# Altium schematic sheet PLC1_3.SchDoc
size 420 x 297 mm; SheetNumber: 3; Scale: {Масш.}; Title1str: {Наименование}; PageSetup: Record=PageOptions|CenterHorizontal=False|CenterVertical=False|PrintScale=0.67|XCorrection=0.00|YCorrection=0.00|PrintKind=1|BorderSize=5000000|LeftOffset=0|BottomOffset=0|Orientation=2|PaperLength=1000|PaperWidth=1000|Scale=100|PaperSource=7|PrintQuality=600|MediaType=1|DitherType=10|PaperKind=A4|PrintScaleMode=1; Title2str: {Наименование}; ProcessInspection: {Т.контр.}; Mass: {Масса}; NormInspection: {Н.контр.}; EngineerName: {Инженер}; Letter1Column: {}; Letter2Column: {}; Letter3Column: {}; DocumentType: ?????????????? ?????; DocumentType1str: {Документ}; DocumentType2str: {Документ}
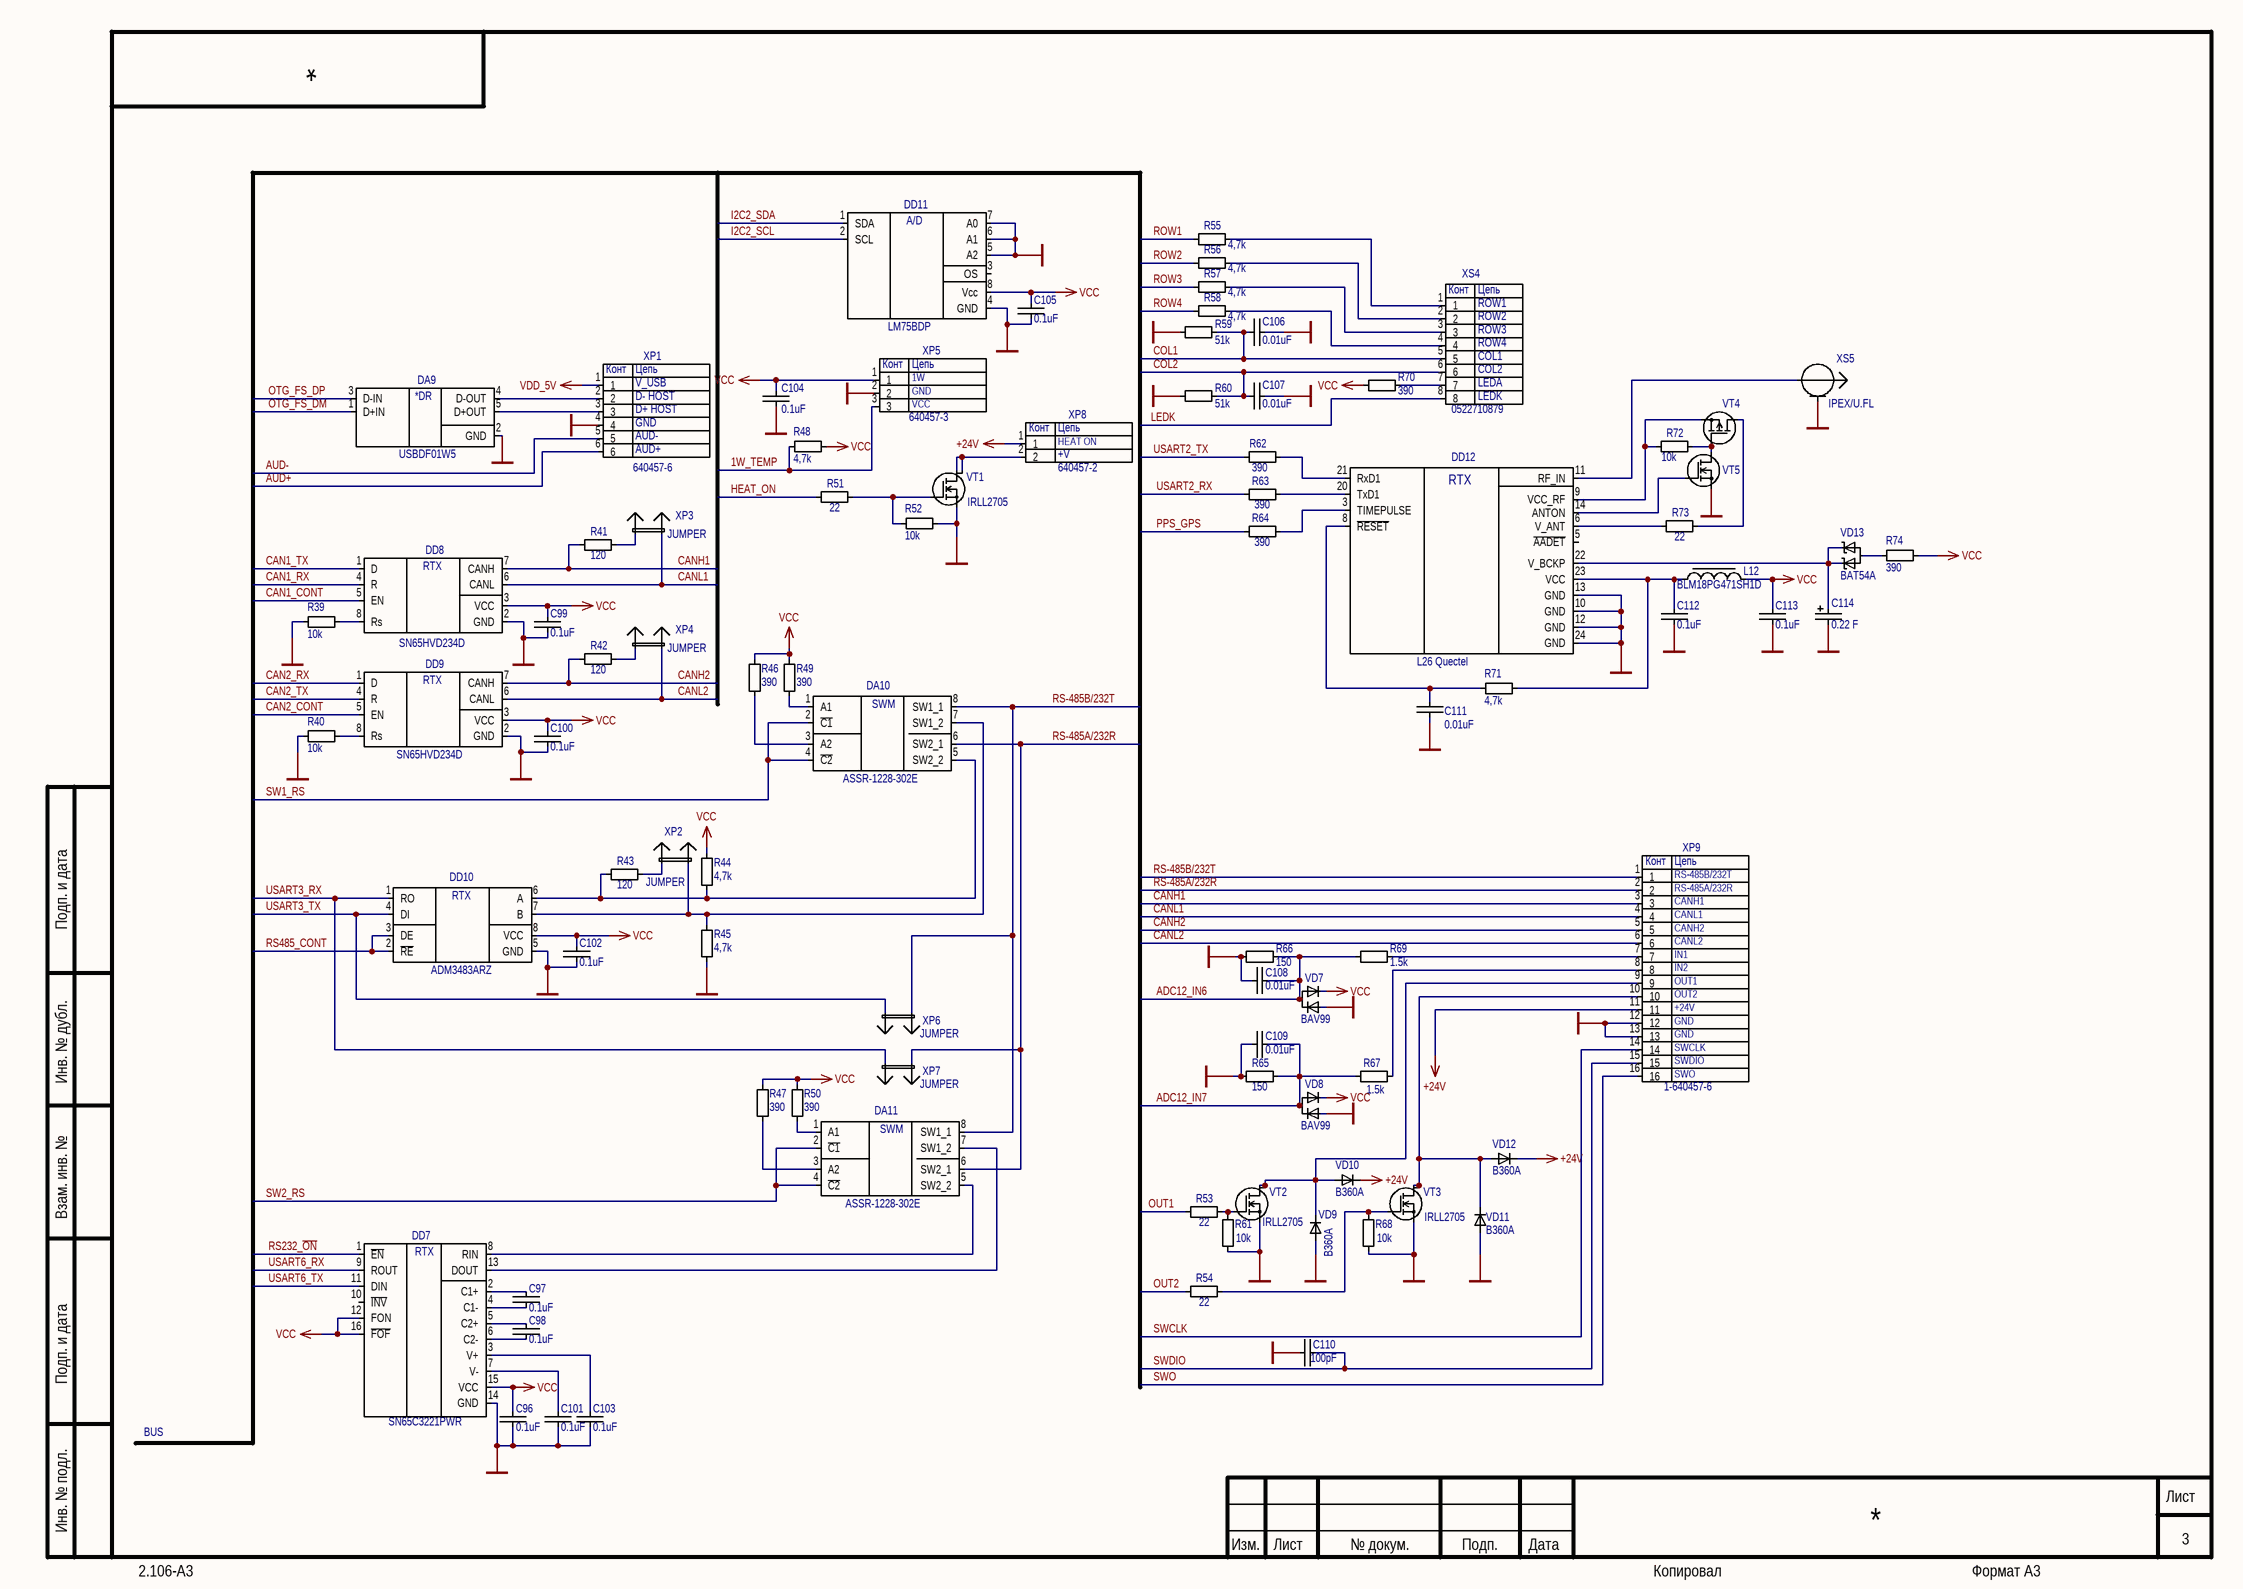
[diagram p0: PLC1_3.SchDoc]

## Parts
C96  0.1uF  [CAP_0603]
C97  0.1uF  [CAP_0603]
C98  0.1uF  [CAP_0603]
C99  0.1uF  [CAP_0603]
C100  0.1uF  [CAP_0603]
C101  0.1uF  [CAP_0603]
C102  0.1uF  [CAP_0603]
C103  0.1uF  [CAP_0603]
C104  0.1uF  [CAP_0603]
C105  0.1uF  [CAP_0603]
C106  0.01uF  [CAP_0603]
C107  0.01uF  [CAP_0603]
C108  0.01uF  [CAP_0603]
C109  0.01uF  [CAP_0603]
C110  value 100pF  [CAP_0603]  (hidden comment: 100p)
C111  0.01uF  [CAP_0603]
C112  0.1uF  [CAP_0603]
C113  0.1uF  [CAP_0603]
C114  0.22 F  [KR-5R5C104-R]
DA9  USBDF01W5  [SOT323-5L]
DA10  ASSR-1228-302E  [DIP8_GULL]
DA11  ASSR-1228-302E  [DIP8_GULL]
DD7  SN65C3221PWR  [TSSO5x6-G16]
DD8  SN65HVD234D  [SOIC8]
DD9  SN65HVD234D  [SOIC8]
DD10  Part Number: ADM3483ARZ  [SOIC8]  (hidden comment: ADM3483)
DD11  LM75BDP  [TSSO3x5-G8/X.4]
DD12  L26 Quectel  [VK1612U]
L12  BLM18PG471SH1D  [R_IND_0603]
R39  10k  [RES_0603]
R40  10k  [RES_0603]
R41  120  [Res_2010]
R42  120  [Res_2010]
R43  120  [Res_2010]
R44  4,7k  [RES_0603]
R45  4,7k  [RES_0603]
R46  390  [RES_0603]
R47  390  [RES_0603]
R48  4,7k  [Res_0603]
R49  390  [RES_0603]
R50  390  [RES_0603]
R51  22  [RES_0603]
R52  10k  [RES_0603]
R53  22  [RES_0603]
R54  22  [RES_0603]
R55  4,7k  [Res_0603]
R56  4,7k  [Res_0603]
R57  4,7k  [Res_0603]
R58  4,7k  [Res_0603]
R59  51k  [RES_0603]
R60  51k  [RES_0603]
R61  10k  [RES_0603]
R62  390  [RES_0603]
R63  390  [RES_0603]
R64  390  [RES_0603]
R65  value 150  [Res_1206]  (hidden comment: Res_1206)
R66  value 150  [Res_1206]  (hidden comment: Res_1206)
R67  value 1.5k  [Res_1206]  (hidden comment: Res_1206)
R68  10k  [RES_0603]
R69  value 1.5k  [Res_1206]  (hidden comment: Res_1206)
R70  390  [RES_0603]
R71  4,7k  [Res_0603]
R72  10k  [RES_0603]
R73  22  [RES_0603]
R74  390  [RES_0603]
VD7  BAV99  [SOT-23]
VD8  BAV99  [SOT-23]
VD9  B360A  [DO-214AC]
VD10  B360A  [DO-214AC]
VD11  B360A  [DO-214AC]
VD12  B360A  [DO-214AC]
VD13  BAT54A  [SOT-23]
VT1  Part Number: IRLL2705  [SOT-223]  (hidden comment: N-CHAN_SOT-223)
VT2  Part Number: IRLL2705  [SOT-223]  (hidden comment: N-CHAN_SOT-223)
VT3  Part Number: IRLL2705  [SOT-223]  (hidden comment: N-CHAN_SOT-223)
VT4  IRLML6402  [SOT-23]  (value not drawn)
VT5  N-CHAN_SOT-23  [SOT-23]  (value not drawn)
XP1  640457-6  [640457-6]
XP2  JUMPER  [PLS2-R]
XP3  JUMPER  [PLS2-R]
XP4  JUMPER  [PLS2-R]
XP5  640457-3  [640457-3]
XP6  JUMPER  [JMPTOPOLOGY]
XP7  JUMPER  [JMPTOPOLOGY]
XP8  640457-2  [640457-2]
XP9  1-640457-6  [1-640457-6]
XS4  0522710879  [0522710879]
XS5  IPEX/U.FL  [IPEX MHFI]

## Nets
+24V: VD10.2 VD12.2 XP8.1 XP9.11
GND: C96.2 C99.2 C100.2 C101.2 C102.2 C103.2 C104.2 C105.2 C106.1 C107.1 C108.1 C109.1 C110.2 C111.2 C112.2 C113.2 C114.2 DA9.2(GND) DD7.14(GND) DD8.2(GND) DD9.2(GND) DD10.5(GND) DD11.4(GND) DD11.5(A2) DD11.6(A1) DD11.7(A0) DD12.10(GND) DD12.12(GND) DD12.13(GND) DD12.24(GND) R39.2 R40.2 R45.2 R52.1 R59.2 R60.2 R61.1 R65.2 R66.2 R68.1 VD7.1 VD8.1 VD9.1 VD11.1 VT1.3 VT2.3 VT3.3 VT5.2 XP1.4 XP5.2 XP9.12 XP9.13 XS5.2
VCC: C96.1 C99.1 C100.1 C102.1 C104.1 C105.1 C113.1 DD7.12(FON) DD7.15(VCC) DD7.16(~{FOF}) DD8.3(VCC) DD9.3(VCC) DD10.8(VCC) DD11.8(Vcc) L12.1 R44.1 R46.1 R47.1 R48.1 R49.1 R50.1 R70.1 R74.2 VD7.2 VD8.2 XP5.1
VDD_5V: XP1.1
1W_TEMP: R48.2 XP5.3
ADC12_IN6: C108.2 R66.1 R69.2 VD7.3
ADC12_IN7: C109.2 R65.1 R67.2 VD8.3
AUD+: XP1.6
AUD-: XP1.5
CAN1_CONT: DD8.5(EN)
CAN1_RX: DD8.4(R)
CAN1_TX: DD8.1(D)
CAN2_CONT: DD9.5(EN)
CAN2_RX: DD9.1(D)
CAN2_TX: DD9.4(R)
CANH1: DD8.7(CANH) R41.1 XP9.3
CANH2: DD9.7(CANH) R42.1 XP9.5
CANL1: DD8.6(CANL) XP3.2 XP9.4
CANL2: DD9.6(CANL) XP4.2 XP9.6
COL1: C106.2 R59.1 XS4.5
COL2: C107.2 R60.1 XS4.6
HEAT_ON: R51.1
I2C2_SCL: DD11.2(SCL)
I2C2_SDA: DD11.1(SDA)
LEDK: XS4.8
OTG_FS_DM: DA9.1(D+IN)
OTG_FS_DP: DA9.3(D-IN)
OUT1: R53.1
OUT2: R54.1
PPS_GPS: R64.1
ROW1: R55.2
ROW2: R56.2
ROW3: R57.2
ROW4: R58.2
RS232_~{ON}: DD7.1(~{EN})
RS485_CONT: DD10.2(~{RE}) DD10.3(DE)
RS-485A/232R: DA10.6(SW2_1) DA11.6(SW2_1) XP7.1 XP9.2
RS-485B/232T: DA10.8(SW1_1) DA11.8(SW1_1) XP6.1 XP9.1
SW1_RS: DA10.2(~{C1}) DA10.4(~{C2})
SW2_RS: DA11.2(~{C1}) DA11.4(~{C2})
SWCLK: XP9.14
SWDIO: C110.1 XP9.15
SWO: XP9.16
USART2_RX: R63.1
USART2_TX: R62.1
USART3_RX: DD10.1(RO) XP7.2
USART3_TX: DD10.4(DI) XP6.2
USART6_RX: DD7.9(ROUT)
USART6_TX: DD7.11(DIN)
NetC97_1: C97.1 DD7.2(C1+)
NetC97_2: C97.2 DD7.4(C1-)
NetC98_1: C98.1 DD7.5(C2+)
NetC98_2: C98.2 DD7.6(C2-)
NetC101_1: C101.1 DD7.7(V-)
NetC103_1: C103.1 DD7.3(V+)
NetC111_1: C111.1 DD12.8(~{RESET}) R71.2
NetC112_1: C112.1 DD12.23(VCC) L12.2 R71.1
NetC114_1: C114.1 DD12.22(V_BCKP) VD13.1 VD13.2
NetDA9_4: DA9.4(D-OUT) XP1.2
NetDA9_5: DA9.5(D+OUT) XP1.3
NetDA10_1: DA10.1(A1) R49.2
NetDA10_3: DA10.3(A2) R46.2
NetDA10_5: DA10.5(SW2_2) DD10.6(A) R43.1 R44.2
NetDA10_7: DA10.7(SW1_2) DD10.7(B) R45.1 XP2.2
NetDA11_1: DA11.1(A1) R50.2
NetDA11_3: DA11.3(A2) R47.2
NetDA11_5: DA11.5(SW2_2) DD7.8(RIN)
NetDA11_7: DA11.7(SW1_2) DD7.13(DOUT)
NetDD8_8: DD8.8(Rs) R39.1
NetDD9_8: DD9.8(Rs) R40.1
NetDD12_3: DD12.3(TIMEPULSE) R64.2
NetDD12_6: DD12.6(V_ANT) R73.1
NetDD12_9: DD12.9(VCC_RF) R72.2 VT4.2
NetDD12_11: DD12.11(RF_IN) XS5.1
NetDD12_14: DD12.14(ANTON) VT5.1
NetDD12_20: DD12.20(TxD1) R63.2
NetDD12_21: DD12.21(RxD1) R62.2
NetR41_2: R41.2 XP3.1
NetR42_2: R42.2 XP4.1
NetR43_2: R43.2 XP2.1
NetR51_2: R51.2 R52.2 VT1.1
NetR53_2: R53.2 R61.2 VT2.1
NetR54_2: R54.2 R68.2 VT3.1
NetR55_1: R55.1 XS4.1
NetR56_1: R56.1 XS4.2
NetR57_1: R57.1 XS4.3
NetR58_1: R58.1 XS4.4
NetR67_1: R67.1 XP9.8
NetR69_1: R69.1 XP9.7
NetR70_2: R70.2 XS4.7
NetR72_1: R72.1 VT4.1 VT5.3
NetR73_2: R73.2 VT4.3
NetR74_1: R74.1 VD13.3
NetVD9_2: VD9.2 VD10.1 VT2.2 VT2.4 XP9.9
NetVD11_2: VD11.2 VD12.1 VT3.2 VT3.4 XP9.10
NetVT1_2: VT1.2 VT1.4 XP8.2

Not connected (* = marked no-connect by the designer): DD7 10(~{INV}); DD11 3(OS); DD12 5(~{AADET})

## Notes on the sheet
- (near XS4) ROW1
- (near XS4) ROW2
- (near XP1) Конт
- (near XP1) V_USB
- (near XP1) Цепь
- (near XP5) Конт
- Цепь
- (near XP5) 1W
- (near XP5) GND
- (near XS4) ROW3
- (near XS4) ROW4
- (near XS4) COL1
- (near XS4) COL2
- (near XS4) LEDA
- (near XP1) D+ HOST
- (near XP1) D- HOST
- (near XP1) GND
- (near XP1) AUD-
- (near XP1) AUD+
- (near XP5) VCC
- (near XP8) Конт
- (near XP8) Цепь
- (near XP8) HEAT ON
- (near XP8) +V
- (near XS4) LEDK
- (near XP9) Конт
- (near XP9) Цепь
- (near XP9) RS-485B/232T
- (near XP9) RS-485A/232R
- (near XP9) CANH1
- (near XP9) CANL1
- (near XP9) CANH2
- (near XP9) CANL2
- (near XP9) IN1
- (near XP9) IN2
- (near XP9) OUT1
- (near XP9) OUT2
- (near XP9) +24V
- (near XP9) GND
- (near XP9) SWCLK
- (near XP9) SWDIO
- (near XP9) SWO
- BUS
- Подп. и дата
- Инв. № дубл.
- Взам. инв. №
- Инв. № подл.
- Изм.
- Лист
- № докум.
- Подп.
- Дата
- 2.106-A3
- Копировал
- Формат А3
- (in symbol 0522710879) Конт; Цепь
- (in symbol ADM3483) RTX
- (in symbol ASSR-1228-302E) SWM
- (in symbol L26 Quectel) RTX
- (in symbol LM75BDP) A/D
- (in symbol SN65C3221PWR) RTX
- (in symbol SN65HVD234D) RTX
- (in symbol USBDF01W6) *DR

## Library data of the parts
C96-C105 C112 C113 = Cap_0603: Manufacturer: AVX; Part Number: 0603YC104KAT2A; Replacement: GRM188R71E104KA12D; PackageReference: 0603; Value: 0.1uF; Distributor: http://www.rospek.ru; Price: 0.001$
C106-C109 C111 = Cap_0603: Manufacturer: AVX; Part Number: 0603YC103KAT2A; Replacement: GRM188R71E103KA12D; PackageReference: 0603; Value: 0.01uF; Distributor: http://www.rospek.ru; Price: 0.001$
C110 = Cap_0603: Manufacturer: Yageo; Part Number: CC0603JRNPO9BN101; Replacement: 100pF 0603 NP0; PackageReference: 0603; Distributor: http://www.platan.ru/; Price: 0.02$
C114 = KR-5R5C104-R: supercapacitor 0.22 uF; Manufacturer: Panasonic; Replacement: KR-5R5C224-R; Value: 0.1F; PackageReference: AXIAL 10; Part Number: KR-5R5C224-R; Distributor: panasonic.com; Price: 0.6$
DA9 = USBDF01W6: Unidirectional 2 lines Filter + ESD; Manufacturer: ST; Replacement: USBDF02W5; Price: 0.5$; Distributor: http://st.com; PackageReference: SOT-323-5; Part Number: USBDF01W5
DA10 DA11 = ASSR-1228-302E: RS-485 PHY; Manufacturer: AVAGO; Price: 2.1$; Distributor: http://www.avagotech.com; Value: ASSR-1228-302E; Replacement: ASSR-1228-302E; PackageReference: PDIP-8 GULL; Part Number: ASSR-1228-302E
DD7 = SN65C3221PWR: RS-232 PHY CAN PHY; Manufacturer: TI; Replacement: SP3221E EXAR; Price: 1.05$; Distributor: http://ti.com; PackageReference: TSSOP-16; Part Number: SN65C3221PWR
DD8 DD9 = SN65HVD234D: SN65HVD234D CAN PHY; Manufacturer: TI; Price: 1.5$; Distributor: http://ti.com; Replacement: SN65HVD234D; PackageReference: SO-8; Part Number: SN65HVD234D
DD10 = ADM3483: RS-485 PHY; Manufacturer: Analog Devices; Price: 1.1$; Distributor: http://analog.com; Replacement: ADM3483ARZ; PackageReference: SO-8 narrow
DD11 = LM75BDP: LM75BDP TEMPERATURE SENSOR; Manufacturer: NXP; Price: 0.4$; Distributor: http://nxp.com; Replacement: LM75BDP; PackageReference: TSSOP; Part Number: LM75BDP
DD12 = L26 Quectel: GPS receiver; Price: 8$; Replacement: L26 Quectel; PackageReference: LLC 24; Manufacturer: Quectel; Part Number: L26 Quectel
L12 = FCM1608KF-601T03: Manufacturer: Murata; Replacement: 600 ohm @100 MHz; PackageReference: 0603; Part Number: BLM18PG471SH1D; Distributor: http://www.chipdip.ru; Price: 0.1$; Value: BLM18PG471SH1D
R39 R40 R52 R61 R68 R72 = Res_0603: 0603, 10k; Manufacturer: Vishay; Part Number: CRCW060310K0JNE; Replacement: 0603 10 kOhm 5%; PackageReference: 0603; Distributor: http://www.kontest.ru; Price: 0.01$; Value: 10k
R41-R43 = Res_2010: 2010; Manufacturer: NIC Components Corp.; Part Number: NRC50J121TRF; PackageReference: 2010; Value: 120; Price: 0.1$
R44 R45 R48 R55-R58 R71 = Res_0603: 0603, 100; Manufacturer: Vishay; Part Number: CRCW0603-472JRT1; Replacement: 0603 4.7 kOhm 5%; PackageReference: 0603; Value: 4,7k; Distributor: http://www.kontest.ru; Price: 0.01$
R46 R47 R49 R50 R62-R64 R70 R74 = Res_0603: 0603, 390; Manufacturer: YAGEO; Part Number: RC0603FR-07390RL; Replacement: 0603 390 5%; PackageReference: 0603; Value: 390; Price: 0.004$
R51 R53 R54 R73 = Res_0603: 0603, 22; Manufacturer: Vishay; Part Number: CRCW020122R0JNED; Replacement: 0603 22 Ohm 5%; PackageReference: 0603; Distributor: http://www.kontest.ru; Price: 0.01$; Value: 22
R59 R60 = Res_0603: 0603, 51k; Manufacturer: Vishay; Part Number: CRCW0603-513JRT1; Replacement: 0603 51 kOhm 5%; PackageReference: 0603; Distributor: http://www.kontest.ru; Price: 0.01$
R65 R66 = Res_1206: Manufacturer: Vishay; Part Number: CRCW1206150RFKEA; Replacement: 150 Ohm 1%; PackageReference: 1206; Price: 0.1$
R67 R69 = Res_1206: Manufacturer: Vishay; Part Number: CRCW12061K50FKEA; Replacement: 1.5 kOhm 1%; PackageReference: 1206; Price: 0.1$
VD7 VD8 = BAV99: Manufacturer: Fairchild; Distributor: Fairchild; Part Number: BAV99
VD9-VD12 = S1A: Manufacturer: VISHAY; Price: 3; Distributor: http://www.chipdip.ru/; Part Number: B360A; PackageReference: DO-214AC
VT4 = P-CHAN_SOT-23: Part Number: IRLML6402
VT5 = N-CHAN_SOT-23: Manufacturer: IR; Part Number: IRLML2502; Replacement: IRLML2402; PackageReference: SOT-23
XP1 = 640457-6: Manufacturer: TE; Price: 0.19$; Part Number: 640457-6
XP2-XP4 = PLS-2 R: JUMPER 2.54; Manufacturer: TE; Part Number: PLS-2R; Distributor: www.brownbear.ru; Price: 0.05$
XP5 = 640457-3: Manufacturer: TE; Price: 0.16$; Distributor: digikey; Part Number: 640457-3
XP6 XP7 = TOPOLOGYJMP: JUMPER 2.54; Manufacturer: TE; Value: JMP; Price: 0.05$
XP8 = 640457-2: Manufacturer: TE; Price: 0.11; Distributor: digikey; Part Number: 640457-2
XP9 = 1-640457-6: Manufacturer: TE; Distributor: digikey; Part Number: 1-640457-6
XS4 = 0522710879: Manufacturer: Molex; Price: 0.8$; Value: 0522710879; Part Number: 0522710879
XS5 = IPEX/U.FL: IPEX/U.FL male pcb SMT; Manufacturer: taoglas limited; Part Number: 20279-001E-01; Replacement: J983TR-ND; PackageReference: IPEX/U.FL
VD13 = BAT54A: Part Number: BAT54A
VT1-VT3 = N-CHAN_SOT-223: PackageReference: SOT-223 TO-261AA